# Altium project 电子实习.PrjPCB
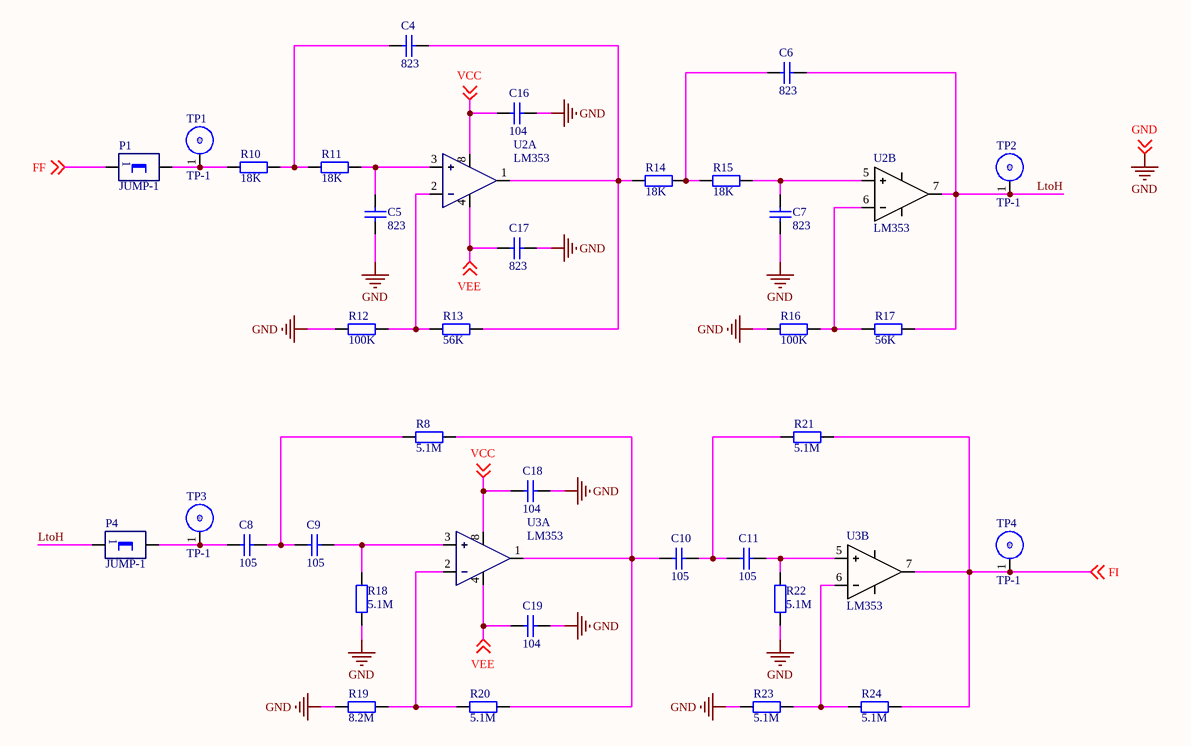
[diagram p0: filter.SchDoc]
3 sheets, 93 parts. Net scope: global (net labels, ports and power ports of the same name join across sheets).
Board file: test.PcbDoc
Sheets:
  filter.SchDoc
  frontscript.SchDoc
  rearscript.SchDoc

## Sheet filter.SchDoc
size A4

### Parts
C4  823  [C2]
C5  823  [C2]
C6  823  [C2]
C7  823  [C2]
C8  105  [C2]
C9  105  [C2]
C10  105  [C2]
C11  105  [C2]
C16  104  [C2]
C17  823  [C2]
C18  104  [C2]
C19  104  [C2]
P1  JUMP-1  [SIP2]
P4  JUMP-1  [SIP2]
R8  5.1M  [AXIAL-0.3]
R10  18K  [AXIAL-0.3]
R11  18K  [AXIAL-0.3]
R12  100K  [AXIAL-0.3]
R13  56K  [AXIAL-0.3]
R14  18K  [AXIAL-0.3]
R15  18K  [AXIAL-0.3]
R16  100K  [AXIAL-0.3]
R17  56K  [AXIAL-0.3]
R18  5.1M  [AXIAL-0.3]
R19  8.2M  [AXIAL-0.3]
R20  5.1M  [AXIAL-0.3]
R21  5.1M  [AXIAL-0.3]
R22  5.1M  [AXIAL-0.3]
R23  5.1M  [AXIAL-0.3]
R24  5.1M  [AXIAL-0.3]
TP1  TP-1  [tp-1-1]
TP2  TP-1  [tp-1-1]
TP3  TP-1  [tp-1-1]
TP4  TP-1  [tp-1-1]
U2  LM353  [DIP8]  (parts A,B of 2)
U3  LM353  [DIP8]  (parts A,B of 2)

### Nets
GND: C5.1 C7.1 C16.2 C17.2 C18.2 C19.2 R12.1 R16.1 R18.1 R19.1 R22.1 R23.1 ; off-sheet GND
FF: P1.1 ; off-sheet FF
FI: R21.2 R24.2 TP4.1 U3.7 ; off-sheet FI
LtoH: C6.2 P4.1 R17.2 TP2.1 U2.7
VCC: C16.1 C18.1 U2.8 U3.8 ; off-sheet VCC
VEE: C17.1 C19.1 U2.4 U3.4 ; off-sheet VEE
NetC4_1: C4.1 R10.2 R11.1
NetC4_2: C4.2 R13.2 R14.1 U2.1
NetC5_2: C5.2 R11.2 U2.3
NetC6_1: C6.1 R14.2 R15.1
NetC7_2: C7.2 R15.2 U2.5
NetC8_1: C8.1 P4.2 TP3.1
NetC8_2: C8.2 C9.1 R8.1
NetC9_2: C9.2 R18.2 U3.3
NetC10_1: C10.1 R8.2 R20.2 U3.1
NetC10_2: C10.2 C11.1 R21.1
NetC11_2: C11.2 R22.2 U3.5
NetP1_2: P1.2 R10.1 TP1.1
NetR12_2: R12.2 R13.1 U2.2
NetR16_2: R16.2 R17.1 U2.6
NetR19_2: R19.2 R20.1 U3.2
NetR23_2: R23.2 R24.1 U3.6

### Library data of the parts
C4-C7 = Cap: Capacitor; Value: 82000pF; Published: 8-Jun-2000; LatestRevisionDate: 17-Jul-2002; LatestRevisionNote: Re-released for DXP Platform.; PackageReference: RAD-0.3; Publisher: Altium Limited; PackageDescription: Radial Cap, Thru-Hole; 2 Leads; 0.3 in Pin Spacing
C8-C11 = Cap: Capacitor; Value: 1000000pF; Published: 8-Jun-2000; LatestRevisionDate: 17-Jul-2002; LatestRevisionNote: Re-released for DXP Platform.; PackageReference: RAD-0.3; Publisher: Altium Limited; PackageDescription: Radial Cap, Thru-Hole; 2 Leads; 0.3 in Pin Spacing
C16 C18 C19 = Cap: Capacitor; Value: 100000pF; Published: 8-Jun-2000; LatestRevisionDate: 17-Jul-2002; LatestRevisionNote: Re-released for DXP Platform.; PackageReference: RAD-0.3; Publisher: Altium Limited; PackageDescription: Radial Cap, Thru-Hole; 2 Leads; 0.3 in Pin Spacing
C17 = Cap: Capacitor; Value: 10000pF; Published: 8-Jun-2000; LatestRevisionDate: 17-Jul-2002; LatestRevisionNote: Re-released for DXP Platform.; PackageReference: RAD-0.3; Publisher: Altium Limited; PackageDescription: Radial Cap, Thru-Hole; 2 Leads; 0.3 in Pin Spacing
R8 R18 R20-R24 = Res2: Resistor; Value: 5100K; Published: 8-Jun-2000; LatestRevisionDate: 17-Jul-2002; LatestRevisionNote: Re-released for DXP Platform.; PackageReference: AXIAL-0.4; Publisher: Altium Limited; PackageDescription: Axial Device, Thru-Hole; 2 Leads; 0.4 in Pin Spacing
R10-R17 = Res2: Resistor; Published: 8-Jun-2000; LatestRevisionDate: 17-Jul-2002; LatestRevisionNote: Re-released for DXP Platform.; PackageReference: AXIAL-0.4; Publisher: Altium Limited; PackageDescription: Axial Device, Thru-Hole; 2 Leads; 0.4 in Pin Spacing
  R10 R11 R14 R15: Value: 18K
  R12 R16: Value: 100K
  R13 R17: Value: 56K
R19 = Res2: Resistor; Value: 8200K; Published: 8-Jun-2000; LatestRevisionDate: 17-Jul-2002; LatestRevisionNote: Re-released for DXP Platform.; PackageReference: AXIAL-0.4; Publisher: Altium Limited; PackageDescription: Axial Device, Thru-Hole; 2 Leads; 0.4 in Pin Spacing

## Sheet frontscript.SchDoc
size A4
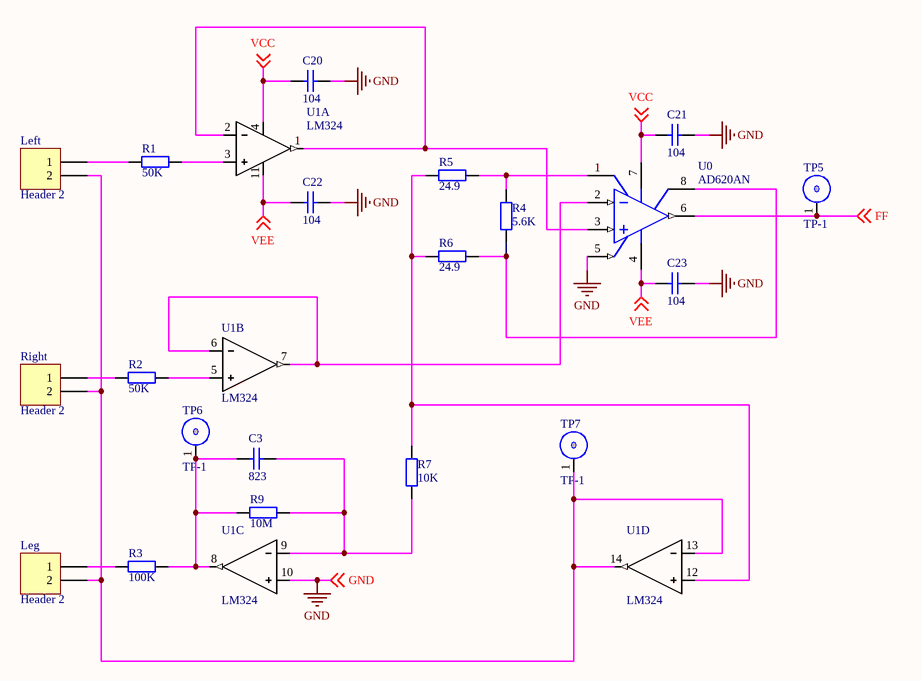
[diagram p1: frontscript.SchDoc]

### Parts
C3  823  [C2]
C20  104  [C2]
C21  104  [C2]
C22  104  [C2]
C23  104  [C2]
Left  Header 2  [SIP2L]
Leg  Header 2  [SIP2L]
R1  50K  [AXIAL-0.3]
R2  50K  [AXIAL-0.3]
R3  100K  [AXIAL-0.3]
R4  5.6K  [AXIAL-0.3]
R5  24.9  [AXIAL-0.3]
R6  24.9  [AXIAL-0.3]
R7  10K  [AXIAL-0.3]
R9  10M  [AXIAL-0.3]
Right  Header 2  [SIP2L]
TP5  TP-1  [tp-1-1]
TP6  TP-1  [tp-1-1]
TP7  TP-1  [tp-1-1]
U0  AD620AN  [DIP8]
U1  LM324  [DIP14]  (parts A,B,C,D of 4)

### Nets
GND: C20.2 C21.2 C22.2 C23.2 U0.5(REF) U1.10 ; off-sheet GND
FF: TP5.1 U0.6(OUT) ; off-sheet FF
VCC: C20.1 C21.1 U0.7(V+) U1.4 ; off-sheet VCC
VEE: C22.1 C23.1 U0.4(V-) U1.11 ; off-sheet VEE
NetC3_1: C3.1 R3.2 R9.1 TP6.1 U1.8
NetC3_2: C3.2 R7.1 R9.2 U1.9
NetLeft_1: Left.1 R1.1
NetLeft_2: Left.2 Leg.2 Right.2 TP7.1 U1.13 U1.14
NetLeg_1: Leg.1 R3.1
NetR1_2: R1.2 U1.3
NetR2_1: R2.1 Right.1
NetR2_2: R2.2 U1.5
NetR4_1: R4.1 R6.2 U0.8(RG)
NetR4_2: R4.2 R5.2 U0.1(RG)
NetR5_1: R5.1 R6.1 R7.2 U1.12
NetU0_2: U0.2(-IN) U1.6 U1.7
NetU0_3: U0.3(+IN) U1.1 U1.2

### Library data of the parts
C3 = Cap: Capacitor; Value: 82000pF; Published: 8-Jun-2000; LatestRevisionDate: 17-Jul-2002; LatestRevisionNote: Re-released for DXP Platform.; PackageReference: RAD-0.3; Publisher: Altium Limited; PackageDescription: Radial Cap, Thru-Hole; 2 Leads; 0.3 in Pin Spacing
C20-C23 = Cap: Capacitor; Value: 100000pF; Published: 8-Jun-2000; LatestRevisionDate: 17-Jul-2002; LatestRevisionNote: Re-released for DXP Platform.; PackageReference: RAD-0.3; Publisher: Altium Limited; PackageDescription: Radial Cap, Thru-Hole; 2 Leads; 0.3 in Pin Spacing
Left Leg Right = Header 2: Header, 2-Pin; LatestRevisionDate: 17-Jul-2002; LatestRevisionNote: Re-released for DXP Platform.; Publisher: Altium Limited
R1-R7 = Res2: Resistor; Published: 8-Jun-2000; LatestRevisionDate: 17-Jul-2002; LatestRevisionNote: Re-released for DXP Platform.; PackageReference: AXIAL-0.4; Publisher: Altium Limited; PackageDescription: Axial Device, Thru-Hole; 2 Leads; 0.4 in Pin Spacing
  R1 R2: Value: 50K
  R3: Value: 100K
  R4: Value: 5.6K
  R5 R6: Value: 24.9
  R7: Value: 10K
R9 = Res2: Resistor; Value: 10000K; Published: 8-Jun-2000; LatestRevisionDate: 17-Jul-2002; LatestRevisionNote: Re-released for DXP Platform.; PackageReference: AXIAL-0.4; Publisher: Altium Limited; PackageDescription: Axial Device, Thru-Hole; 2 Leads; 0.4 in Pin Spacing
U0 = AD620AN: Low-Cost, Low-Power Instrumentation Amplifier; Published: 8-Jun-2000; LatestRevisionDate: 04-Mar-2005; LatestRevisionNote: Stylized 3D Model Added.; DatasheetVersion: REV.D 1998; PackageVersion: revA; PackageReference: N-8; Publisher: Altium Limited; PackageDescription: DIP; 8 Leads; Row Spacing 7.62 mm; Pitch 2.54 mm; ComponentLink1Description: Manufacturer Link; ComponentLink1URL: http://www.analog.com/en/prod/0%2C2877%2CAD620%2C00.html; ComponentLink2Description: Datasheet; ComponentLink2URL: http://www.analog.com/UploadedFiles/Data_Sheets/897653854AD620_g.pdf

## Sheet rearscript.SchDoc
size A4
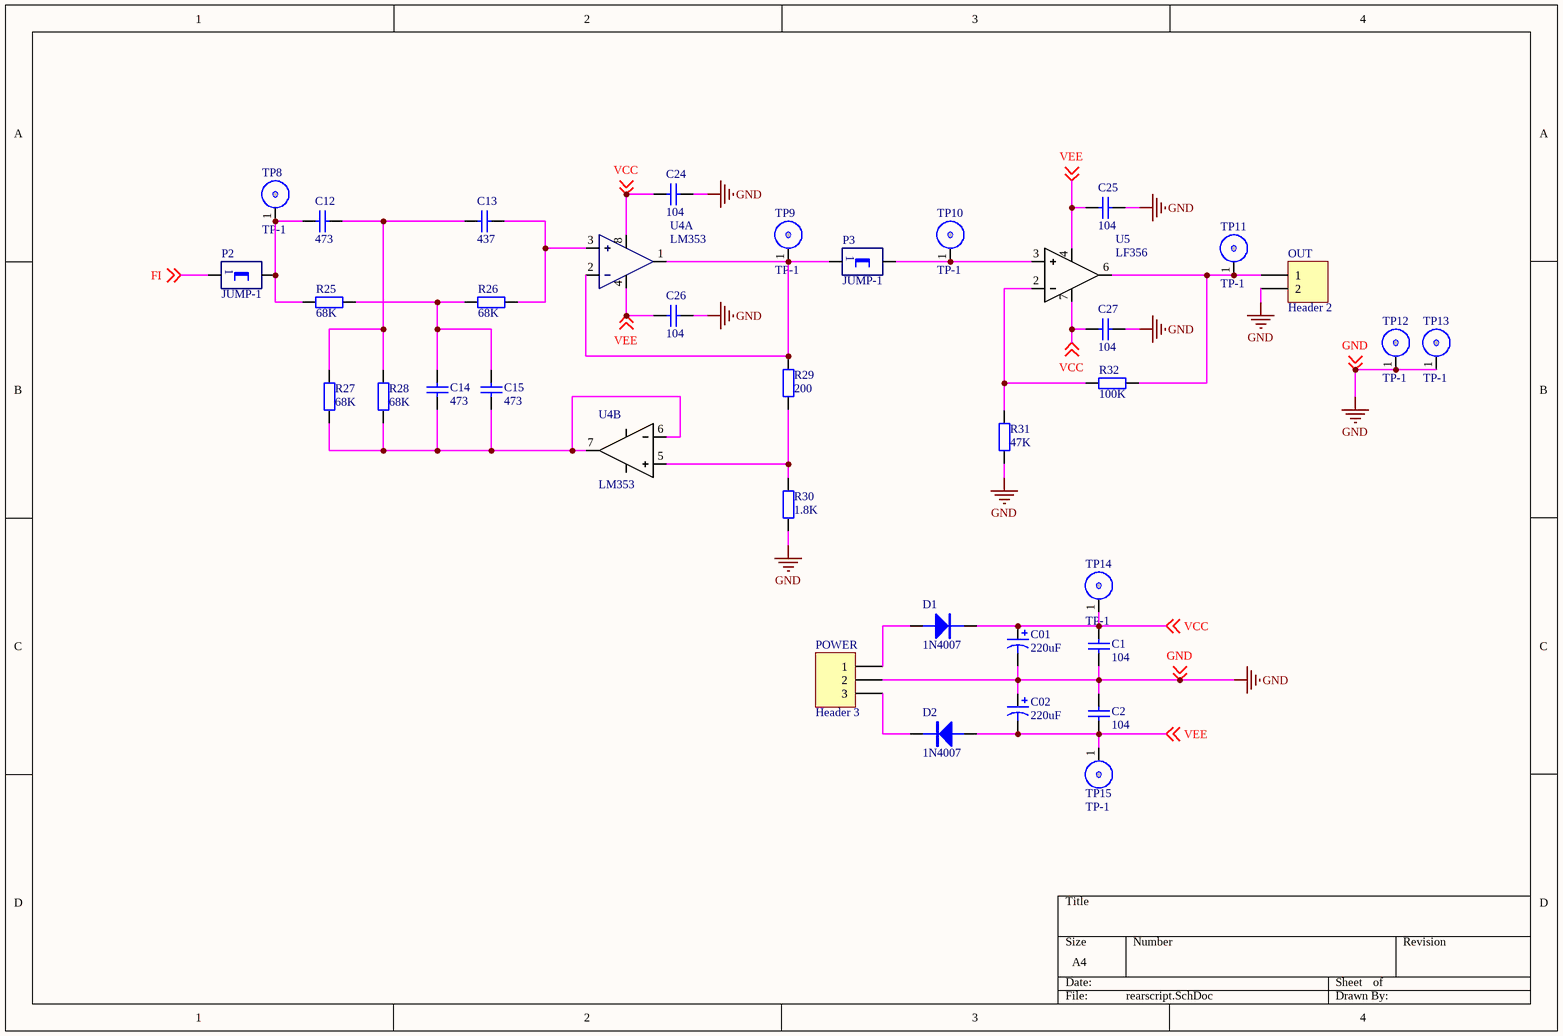
[diagram p2: rearscript.SchDoc]

### Parts
C1  104  [C2]
C01  220uF  [RB.15/.3]
C2  104  [C2]
C02  220uF  [RB.15/.3]
C12  473  [C2]
C13  437  [C2]
C14  473  [C2]
C15  473  [C2]
C24  104  [C2]
C25  104  [C2]
C26  104  [C2]
C27  104  [C2]
D1  1N4007  [DIODE0.4]
D2  1N4007  [DIODE0.4]
OUT  Header 2  [SIP2L]
P2  JUMP-1  [SIP2]
P3  JUMP-1  [SIP2]
POWER  Header 3  [POWER3]
R25  68K  [AXIAL-0.3]
R26  68K  [AXIAL-0.3]
R27  68K  [AXIAL-0.3]
R28  68K  [AXIAL-0.3]
R29  200  [AXIAL-0.3]
R30  1.8K  [AXIAL-0.3]
R31  47K  [AXIAL-0.3]
R32  100K  [AXIAL-0.3]
TP8  TP-1  [tp-1-1]
TP9  TP-1  [tp-1-1]
TP10  TP-1  [tp-1-1]
TP11  TP-1  [tp-1-1]
TP12  TP-1  [tp-1-1]
TP13  TP-1  [tp-1-1]
TP14  TP-1  [tp-1-1]
TP15  TP-1  [tp-1-1]
U4  LM353  [DIP8]  (parts A,B of 2)
U5  LF356  [DIP8]

### Nets
GND: C1.1 C01.2 C02.1 C2.2 C24.2 C25.2 C26.2 C27.2 OUT.2 POWER.2 R30.1 R31.1 TP12.1 TP13.1 ; off-sheet GND
FI: P2.1 ; off-sheet FI
VCC: C01.1 C1.2 C24.1 C27.1 D1.2 TP14.1 U4.8 U5.7 ; off-sheet VCC
VEE: C2.1 C02.2 C25.1 C26.1 D2.1 TP15.1 U4.4 U5.4 ; off-sheet VEE
NetC12_1: C12.1 P2.2 R25.1 TP8.1
NetC12_2: C12.2 C13.1 R27.2 R28.2
NetC13_2: C13.2 R26.2 U4.3
NetC14_1: C14.1 C15.1 R27.1 R28.1 U4.6 U4.7
NetC14_2: C14.2 C15.2 R25.2 R26.1
NetD1_1: D1.1 POWER.1
NetD2_2: D2.2 POWER.3
NetOUT_1: OUT.1 R32.2 TP11.1 U5.6
NetP3_1: P3.1 R29.2 TP9.1 U4.1 U4.2
NetP3_2: P3.2 TP10.1 U5.3
NetR29_1: R29.1 R30.2 U4.5
NetR31_2: R31.2 R32.1 U5.2

### Library data of the parts
C1 C2 C24-C26 = Cap: Capacitor; Value: 100000pF; Published: 8-Jun-2000; LatestRevisionDate: 17-Jul-2002; LatestRevisionNote: Re-released for DXP Platform.; PackageReference: RAD-0.3; Publisher: Altium Limited; PackageDescription: Radial Cap, Thru-Hole; 2 Leads; 0.3 in Pin Spacing
C01 C02 = Cap Pol1: Polarized Capacitor (Radial); Published: 8-Jun-2000; LatestRevisionDate: 17-Jul-2002; LatestRevisionNote: Re-released for DXP Platform.; PackageReference: RB7.6-15; Publisher: Altium Limited; PackageDescription: Polarized Capacitor (Radial); 2 Leads; Value: 220uF
C12 C14 C15 = Cap: Capacitor; Value: 47000pF; Published: 8-Jun-2000; LatestRevisionDate: 17-Jul-2002; LatestRevisionNote: Re-released for DXP Platform.; PackageReference: RAD-0.3; Publisher: Altium Limited; PackageDescription: Radial Cap, Thru-Hole; 2 Leads; 0.3 in Pin Spacing
C13 C27 = Cap: Capacitor; Value: 4700pF; Published: 8-Jun-2000; LatestRevisionDate: 17-Jul-2002; LatestRevisionNote: Re-released for DXP Platform.; PackageReference: RAD-0.3; Publisher: Altium Limited; PackageDescription: Radial Cap, Thru-Hole; 2 Leads; 0.3 in Pin Spacing
D1 D2 = DIODE: pin to pad: 1>A 2>K
OUT = Header 2: Header, 2-Pin; LatestRevisionDate: 17-Jul-2002; LatestRevisionNote: Re-released for DXP Platform.; Publisher: Altium Limited
POWER = Header 3: Header, 3-Pin; LatestRevisionDate: 17-Jul-2002; LatestRevisionNote: Re-released for DXP Platform.; Publisher: Altium Limited
R25-R32 = Res2: Resistor; Published: 8-Jun-2000; LatestRevisionDate: 17-Jul-2002; LatestRevisionNote: Re-released for DXP Platform.; PackageReference: AXIAL-0.4; Publisher: Altium Limited; PackageDescription: Axial Device, Thru-Hole; 2 Leads; 0.4 in Pin Spacing
  R25-R28: Value: 68K
  R29: Value: 200
  R30: Value: 1.8K
  R31: Value: 47K
  R32: Value: 100K

## Nets that join several sheets
GND: filter (12 pins), frontscript (6 pins), rearscript (14 pins)
FF: filter (P1.1), frontscript (TP5.1 U0.6)
FI: filter (R21.2 R24.2 TP4.1 U3.7), rearscript (P2.1)
VCC: filter (C16.1 C18.1 U2.8 U3.8), frontscript (C20.1 C21.1 U0.7 U1.4), rearscript (8 pins)
VEE: filter (C17.1 C19.1 U2.4 U3.4), frontscript (C22.1 C23.1 U0.4 U1.11), rearscript (8 pins)